# EAGLE design BuckTest2 (EAGLE 5.11)
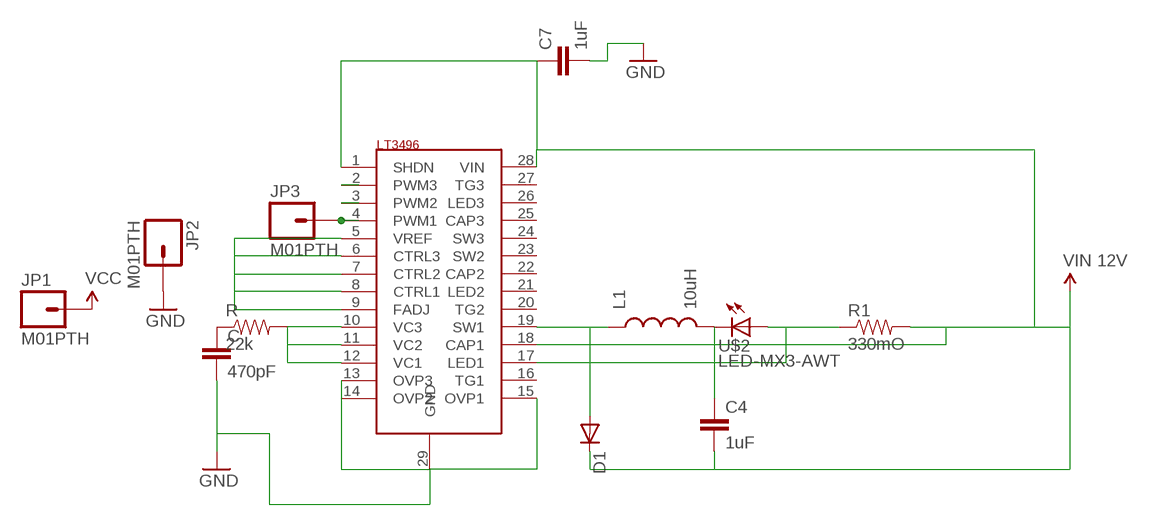
[diagram p0: schematic, sheet 1]

## Parts
C  470pF  CAP1206  [1206]
C4  1uF  CAP1206  [1206]
C7  1uF  CAP1206  [1206]
D1  DIODESMB  [SMB-DIODE]
JP1  M01PTH  [1X01]
JP2  M01PTH  [1X01]
JP3  M01PTH  [1X01]
L1  10uH  INDUCTOR1206H*  [INDUCTOR-1206]
R  22k  RESISTOR0603-RES  [0603-RES]
R1  330mO  RESISTOR0603-RES  [0603-RES]
U$1  LT3496TSSOP28  LT3496  [TSSOP28-GROUNDPAD]
U$2  LED-MX3-AWT  [LED-MX3-AWT]

## Nets
GND: C7.2 C.2 JP2.1 U$1.13(OVP3) U$1.14(OVP2) U$1.15(OVP1) U$1.29(GND)
N$1: JP3.1 U$1.4(PWM1)
N$2: U$1.3(PWM2)
N$3: U$1.2(PWM3)
N$4: R.2 U$1.10(VC3) U$1.11(VC2) U$1.12(VC1)
N$5: D1.A L1.P$1 U$1.19(SW1)
N$6: C.1 R.1
N$7: C4.1 L1.P$2 U$2.CATHODE(C)
N$8: R1.1 U$1.17(LED1) U$2.ANODE(A)
N$9: U$1.5(VREF) U$1.6(CTRL3) U$1.7(CTRL2) U$1.8(CTRL1) U$1.9(FADJ)
VCC: C4.2 C7.1 D1.C JP1.1 R1.2 U$1.1(SHDN) U$1.18(CAP1) U$1.28(VIN) ; supply symbol labelled VIN 12V
Unconnected: U$1.16(TG1) U$1.20(TG2) U$1.21(LED2) U$1.22(CAP2) U$1.23(SW2) U$1.24(SW3) U$1.25(CAP3) U$1.26(LED3) U$1.27(TG3)

## Library data of the parts
C C4 C7 = SparkFun:CAP: Capacitor Standard 0603 ceramic capacitor, and 0.1" leaded capacitor.
D1 = SparkFun:DIODE: Diode These are standard reverse protection diodes and small signal diodes. SMA package can handle up to about 1A. SOD-323 can handle about 200mA. What the SOD-323 package when ordering, there are some mfgs out there that are 5-pin packages.
JP1-JP3 = SparkFun:M01: Header 1 Standard 1-pin 0.1" header. Use with straight break away headers (SKU : PRT-00116), right angle break away headers (PRT-00553), swiss pins (PRT-00743), machine pins (PRT-00117), and female headers (PRT-00115).
L1 = SparkFun:INDUCTOR: Inductors Basic Inductor/Choke - 0603 and 1206. Footprints are not proven and vary greatly between part numbers.
R R1 = SparkFun:RESISTOR: Resistor Basic schematic elements and footprints for 0603, 1206, and PTH resistors.
U$1 = SparkFun:LT3496
U$2 = SparkFun:LED-MX3-AWT

## Net classes
0 default: width 0.254 mm, drill 1.016 mm, clearance 0.381 mm

## Board
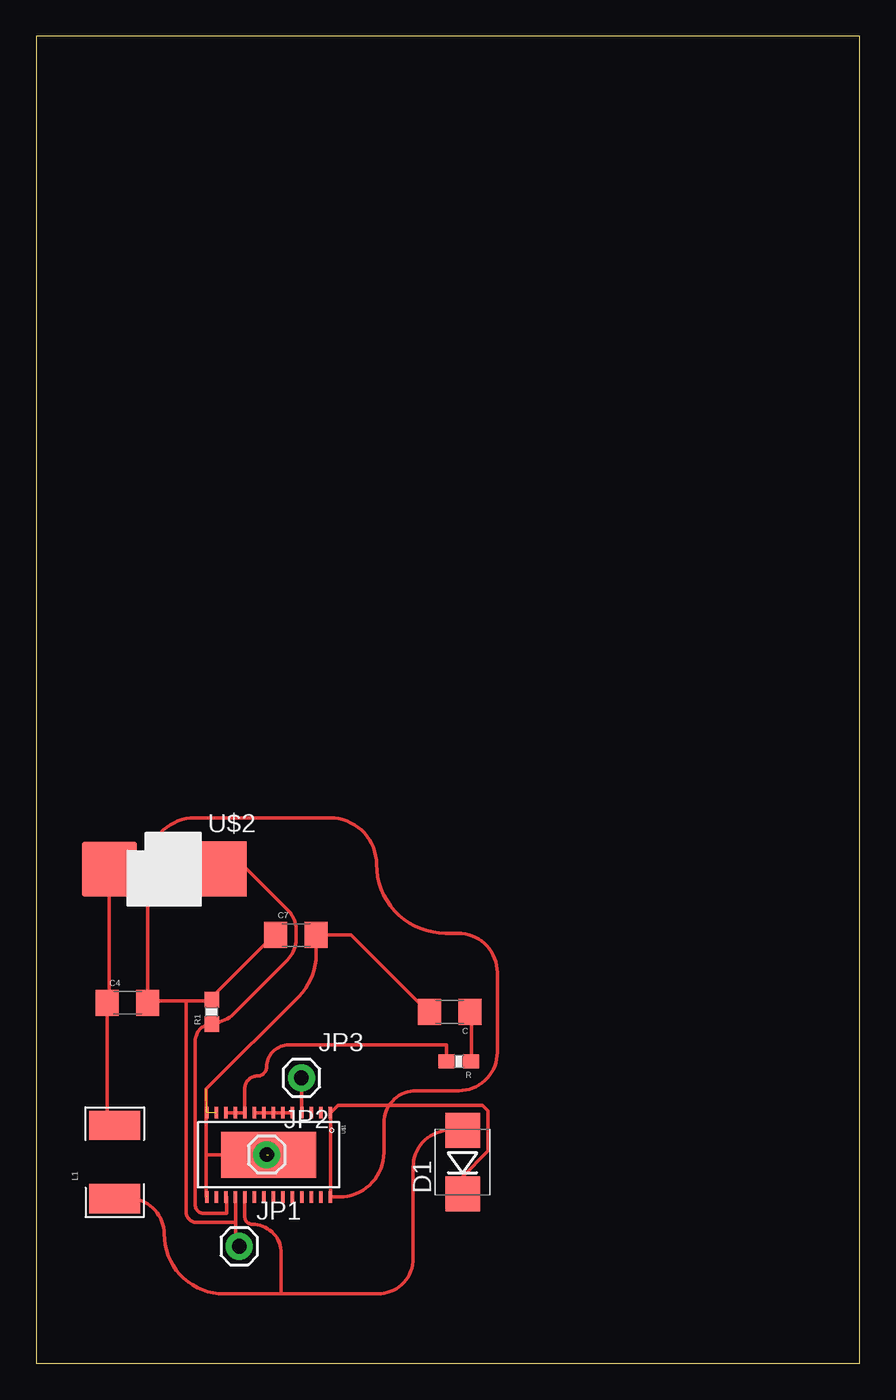
[diagram p1: board, top side]

Size 57.15 x 92.08 mm. Coordinates in mm from the lower left corner, seen from the top.
Outline: 0,0 57.15,0 57.15,92.08 0,92.08 0,0
Copper layers (1*16): Top 0.035mm / dielectric 1.5mm / Bottom 0.035mm
Design rules "default": minimum track width 10mil, minimum drill 24mil, track to track 8mil, track to pad 8mil, pad to pad 8mil, via to via 8mil, smd to smd 8mil, copper to edge 40mil, drill to drill 8mil, minimum pad ring 10mil, minimum via ring 8mil, stop-mask expansion 4mil, vias tented up to drill 0mil, thermal gap 10mil

### Footprints (pad centres in the part's own frame; a part is rotated, then mirrored left to right if it is on the bottom)
1206 = smd 1.6 x 1.8: 1 -1.4,0; 2 1.4,0
SMB-DIODE = smd 2.4 x 2.4: A 2.2,0; C -2.2,0
1X01 = drill 1.016 pad 1.88 round: 1 0,0
INDUCTOR-1206 = smd 2.032 x 3.556: P$1 -2.54,0; P$2 2.54,0
0603-RES = smd 1.1 x 1: 1 -0.85,0; 2 0.85,0
TSSOP28-GROUNDPAD = smd 0.8 x 0.25: 1 -2.921,4.298; 2 -2.921,3.637; 3 -2.921,2.977; 4 -2.921,2.317; 5 -2.921,1.656; 6 -2.921,0.996; 7 -2.921,0.335; 8 -2.927,-0.325; 9 -2.921,-0.985; 10 -2.921,-1.646; 11 -2.921,-2.306; 12 -2.921,-2.967; 13 -2.921,-3.627; 14 -2.921,-4.287; 15 2.921,-4.287; 16 2.921,-3.627; 17 2.921,-2.967; 18 2.921,-2.306; 19 2.921,-1.646; 20 2.921,-0.985; 21 2.927,-0.325; 22 2.921,0.335; 23 2.921,0.996; 24 2.921,1.656; 25 2.921,2.317; 26 2.921,2.977; 27 2.921,3.637; 28 2.921,4.298 | smd 3.2 x 6.6: 29 0,0.005
LED-MX3-AWT = smd 3.81 x 3.81: ANODE -3.81,0; CATHODE 3.81,0

### Placement (x,y rotation side)
C  28.7,24.38 180 top
C4  6.35,25.02 0 top
C7  18.03,29.72 0 top
D1  29.59,13.97 90 top
JP1  14.1,8.13 0 top
JP2  16,14.48 0 top
JP3  18.41,19.81 0 top
L1  5.46,13.97 90 top
R  29.34,20.95 180 top
R1  12.19,24.38 90 top
U$1  16.13,14.48 270 top
U$2  8.89,34.29 180 top

### Tracks (layer width: path | path; a pad name or v marks a point on that pad's centre or on a via)
GND  (4 unrouted)
  Top 0.254: C.2 27.18,24.38 21.84,29.72 C7.2 19.43,28.36 arc-45 18.24,25.48 11.81,19.05 11.81,14.48 | 11.81,11.56 11.81,14.48 | 11.81,14.48 JP2.1
N$1
  Top 0.254: U$1.4 18.41,17.4 JP3.1
N$4
  Top 0.254: U$1.12 U$1.11 | U$1.11 U$1.10 | U$1.11 U$1.10 14.48,19.05 arc-90 15.37,19.94 arc90 16,20.57 arc-90 17.53,22.1 28.49,22.1 R.2
N$5
  Top 0.254: L1.P$1 6.45,11.43 arc-90 8.89,8.99 arc90 13.05,4.83 17.02,4.83 | 17.02,4.83 17.02,7.64 arc90 15.01,9.65 arc-90 14.48,10.18 U$1.19 | D1.A 28.71,16.17 arc90 26.16,13.62 26.16,7.29 arc-90 23.7,4.83 17.02,4.83
N$6
  Top 0.254: R.1 30.23,20.95 30.23,24.38 C.1
N$7
  Top 0.254: C4.1 4.95,17.02 L1.P$2 | U$2.CATHODE 5.08,25.15 C4.1 | C4.1
N$8
  Top 0.254: U$2.ANODE 14.61,34.29 17.55,31.35 arc-45 18.03,30.18 18.03,29.41 arc-45 17.45,27.99 13.71,24.25 arc-45 12.19,23.62 R1.1 arc90 11.05,22.39 11.05,10.98 arc90 11.62,10.41 13.21,10.41 13.21,11.56 U$1.17
N$9
  Top 0.254: U$1.9 15.75,17.4 U$1.8 15.88,17.4 U$1.7 U$1.6 U$1.5
VCC
  Top 0.254: 20.45,17.4 20.45,11.56 U$1.28 21.06,11.56 arc90 24.13,14.63 24.13,16.68 arc-90 26.38,18.92 29.33,18.92 arc90 32,21.59 32,27.12 arc90 29.28,29.84 28.4,29.84 arc-90 23.62,34.63 arc90 20.4,37.85 11.03,37.85 arc90 7.75,34.57 C4.2 7.87,25.02 8,25.15 10.41,25.15 | 20.45,17.4 20.95,17.91 30.99,17.91 31.37,17.53 31.37,14.73 29.59,12.95 D1.C | 20.45,17.4 U$1.1 | 13.84,9.78 13.84,8.38 JP1.1 | 13.84,9.78 13.84,11.56 U$1.18 | 10.41,25.15 11.94,25.15 | 11.94,25.15 12.19,25.15 R1.2 11.94,25.15 | 11.94,25.15 16.51,29.72 C7.1 | 13.84,9.78 11.15,9.78 arc-90 10.41,10.52 10.41,25.15